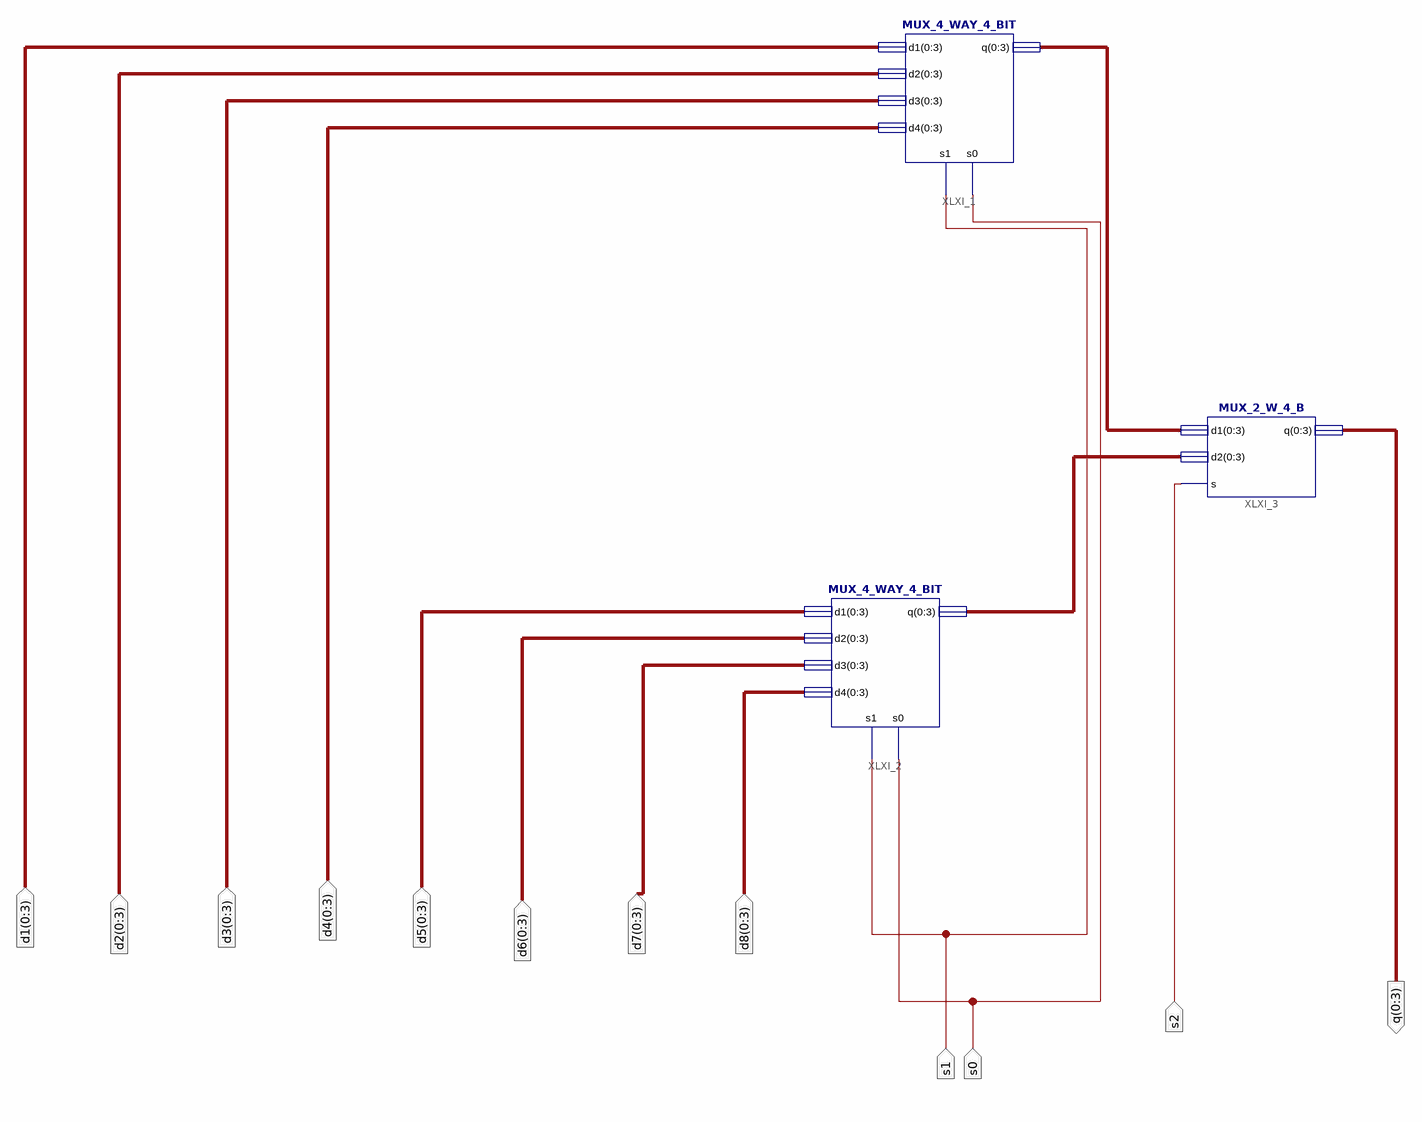
[diagram p0: schematic sheet 1]
// Xilinx ISE schematic MUX_8_WAY_4_BIT.sch (spartan3e) as structural Verilog: 3 symbols, 12 ports
module MUX_8_WAY_4_BIT (
  input  [0:3] d1,
  input  [0:3] d2,
  input  [0:3] d3,
  input  [0:3] d4,
  input  [0:3] d5,
  input  [0:3] d6,
  input  [0:3] d7,
  input  [0:3] d8,
  input  s1,
  input  s0,
  input  s2,
  output [0:3] q
);

  wire [3:0] XLXN_26, XLXN_27;

  MUX_4_WAY_4_BIT XLXI_1 (
    .d1(d1), .d2(d2), .d3(d3), .d4(d4), .q({XLXN_26[0], XLXN_26[1], XLXN_26[2], XLXN_26[3]}), .s1(s1), .s0(s0));
  MUX_4_WAY_4_BIT XLXI_2 (
    .d1(d5), .d2(d6), .d3(d7), .d4(d8), .q({XLXN_27[0], XLXN_27[1], XLXN_27[2], XLXN_27[3]}), .s1(s1), .s0(s0));
  MUX_2_W_4_B XLXI_3 (
    .d1({XLXN_26[0], XLXN_26[1], XLXN_26[2], XLXN_26[3]}),
    .d2({XLXN_27[0], XLXN_27[1], XLXN_27[2], XLXN_27[3]}), .q(q), .s(s2));
endmodule
